# Altium schematic sheet POWER.SchDoc
size A4
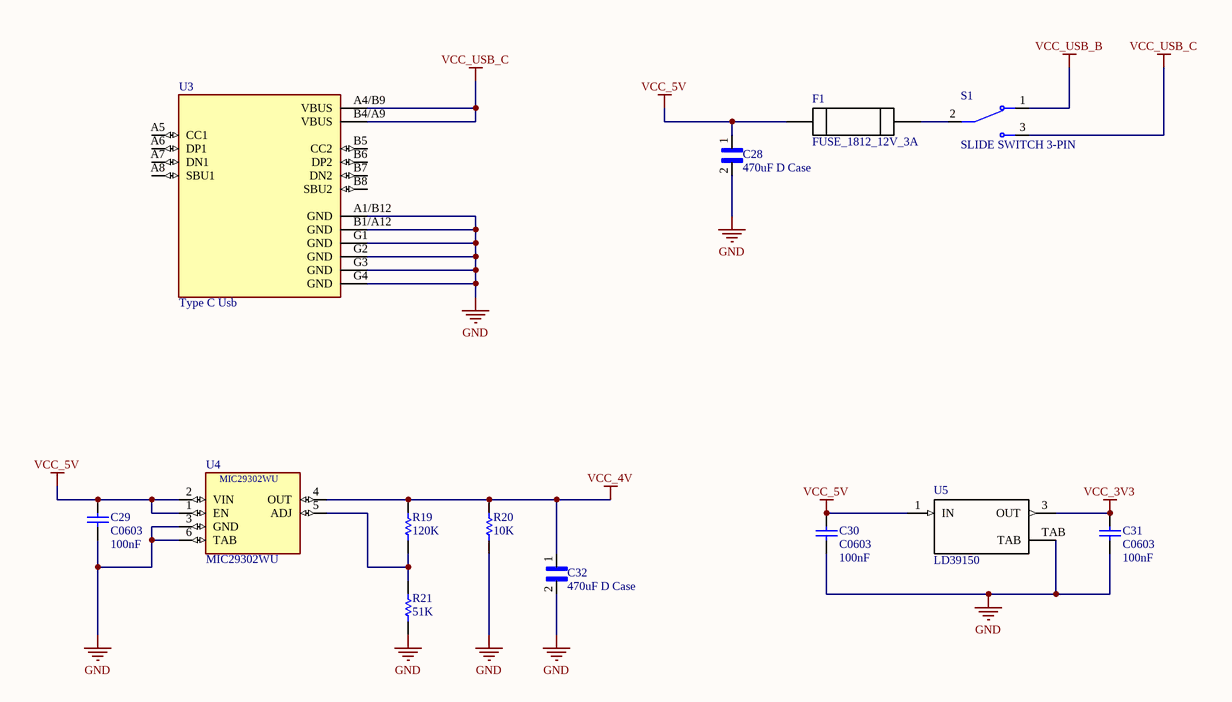
[diagram p0: POWER.SchDoc]

## Parts
C28  470uF D Case  [470uF D Case]
C29  C0603  value 100nF  [C0603]
C30  C0603  value 100nF  [C0603]
C31  C0603  value 100nF  [C0603]
C32  470uF D Case  [470uF D Case]
F1  FUSE_1812_12V_3A  [FUSE_1812_12V_3A]
R19  value 120K  [CC1608-0603]  (hidden comment: Res0603)
R20  value 10K  [CC1608-0603]  (hidden comment: Res0603)
R21  value 51K  [CC1608-0603]  (hidden comment: Res0603)
S1  SLIDE SWITCH 3-PIN  [Slide Switch 3-Pin]
U3  Type C Usb  [Type C Usb]
U4  MIC29302WU  [MIC29302WU]
U5  LD39150  [LD39150DT33-R]

## Nets
GND: C28.2 C29.1 C30.1 C31.1 C32.2 R20.2 R21.2 U3.A1/B12(GND) U3.B1/A12(GND) U3.G1(GND) U3.G2(GND) U3.G3(GND) U3.G4(GND) U4.3(GND) U4.6(TAB) U5.TAB
VCC_3V3: C31.2 U5.3(OUT)
VCC_4V: C32.1 R19.1 R20.1 U4.4(OUT)
VCC_5V: C28.1 C29.2 C30.2 F1.1 U4.1(EN) U4.2(VIN) U5.1(IN)
VCC_USB_B: S1.1
VCC_USB_C: S1.3 U3.A4/B9(VBUS) U3.B4/A9(VBUS)
NetF1_2: F1.2 S1.2
NetR19_2: R19.2 R21.1 U4.5(ADJ)

Not connected (* = marked no-connect by the designer): U3 A5(CC1) A6(DP1) A7(DN1) A8(SBU1) B5(CC2) B6(DP2) B7(DN2) B8(SBU2)

## Library data of the parts
C29-C31 = C0603: Ceramic Chip Capacitor - Standard; Note: Footprint corresponds to dimensions for bulk cassette packaging. This case size has tightened tolerances.; Published: 17-Jul-2002; LatestRevisionDate: 19-Mar-2004; LatestRevisionNote: Silkscreen size reduced.; DatasheetDocument: Mar-2001; PackageDocument: Mar-2001; PackageReference: 0603; Publisher: Altium Limited; Code_JEITA: 0603; Code_IPC: 1608 [0603]; ComponentLink1Description: Manufacturer Link; ComponentLink1URL: http://www.kemet.com/; ComponentLink2Description: Datasheet; ComponentLink2URL: http://www.kemet.com/kemet/web/homepage/kechome.nsf/vapubfilesname/F3102TA.pdf/$file/F3102TA.pdf
R19-R21 = Res0603: Resistor; Manufacturer: Generic Components; Class I: Passive; Published: 8-Jun-2000; Revision: July-2002: Re-released for DXP Platform.; Publisher: Altium Limited; Class II: Resistor